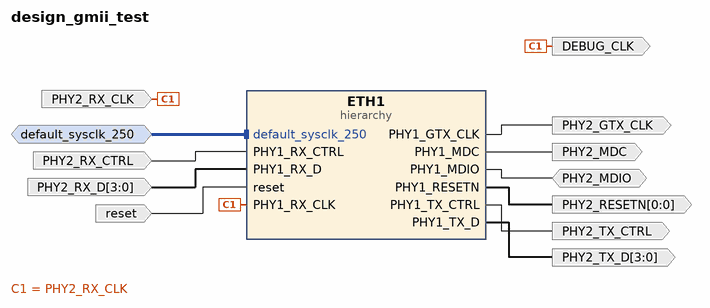
[diagram p0: block diagram of the top level]
# Vivado block design design_gmii_test, xcku040-fbva676-1-c, Vivado 2018.2
create_bd_design design_gmii_test

create_bd_intf_port -mode Slave -vlnv xilinx.com:interface:diff_clock_rtl:1.0 default_sysclk_250
set_property -dict {CONFIG.FREQ_HZ 250000000} [get_bd_intf_ports default_sysclk_250]
create_bd_port -dir I -type clk PHY2_RX_CLK
set_property -dict {CONFIG.FREQ_HZ 125000000} [get_bd_ports PHY2_RX_CLK]
create_bd_port -dir O -type clk DEBUG_CLK
create_bd_port -dir I PHY2_RX_CTRL
create_bd_port -dir I -from 3 -to 0 PHY2_RX_D
create_bd_port -dir O -type clk PHY2_GTX_CLK
create_bd_port -dir O -from 0 -to 0 PHY2_RESETN
create_bd_port -dir I -type rst reset
set_property -dict {CONFIG.POLARITY ACTIVE_HIGH} [get_bd_ports reset]
create_bd_port -dir IO PHY2_MDIO
create_bd_port -dir O -type clk PHY2_MDC
create_bd_port -dir O -from 3 -to 0 PHY2_TX_D
create_bd_port -dir O PHY2_TX_CTRL

create_bd_cell -type hier ETH1

# ---- hierarchy /ETH1 ----
current_bd_instance /ETH1
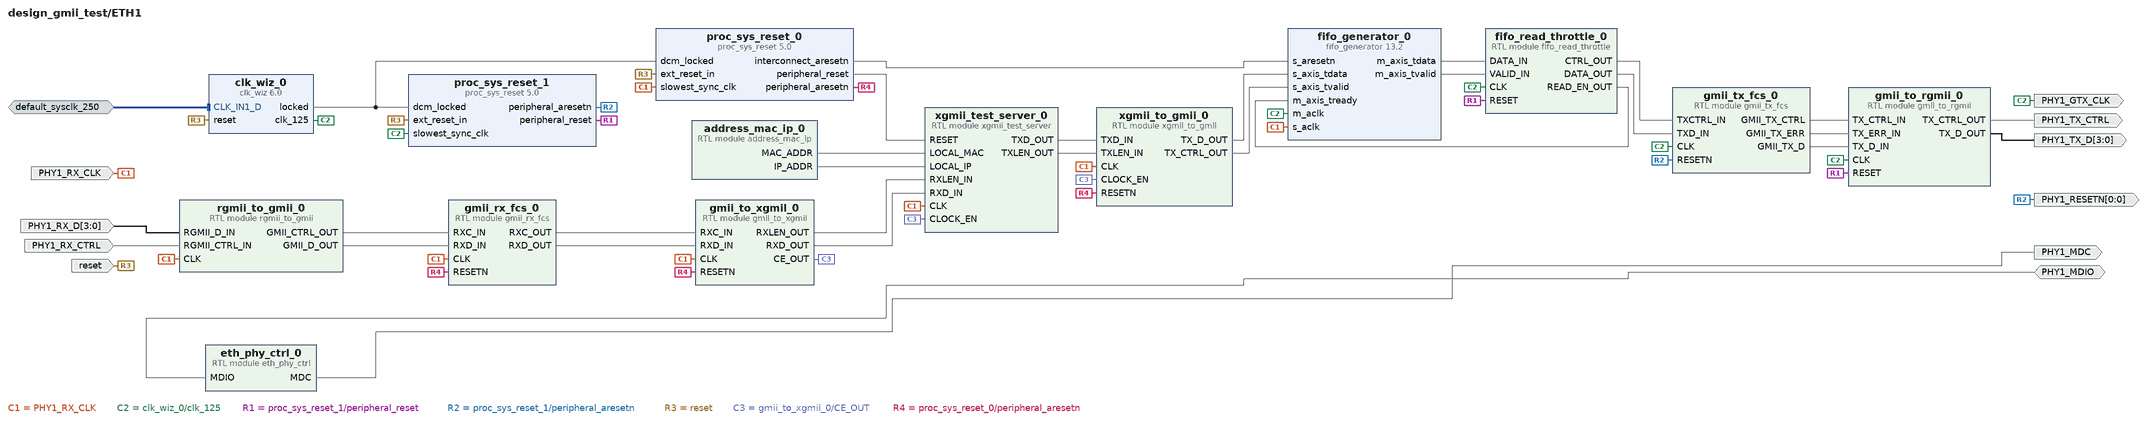
[diagram p1: block diagram inside /ETH1]
create_bd_intf_pin -mode Slave -vlnv xilinx.com:interface:diff_clock_rtl:1.0 default_sysclk_250
create_bd_pin -dir IO PHY1_MDIO
create_bd_pin -dir I -from 3 -to 0 PHY1_RX_D
create_bd_pin -dir I PHY1_RX_CTRL
create_bd_pin -dir O PHY1_MDC
create_bd_pin -dir I -type clk PHY1_RX_CLK
create_bd_pin -dir O -from 3 -to 0 PHY1_TX_D
create_bd_pin -dir O PHY1_TX_CTRL
create_bd_pin -dir I -type rst reset
create_bd_pin -dir O -from 0 -to 0 -type rst PHY1_RESETN
create_bd_pin -dir O -type clk PHY1_GTX_CLK

create_bd_cell -type module -reference gmii_tx_fcs gmii_tx_fcs_0
create_bd_cell -type ip -vlnv xilinx.com:ip:proc_sys_reset:5.0 proc_sys_reset_1
create_bd_cell -type module -reference fifo_read_throttle fifo_read_throttle_0
create_bd_cell -type ip -vlnv xilinx.com:ip:fifo_generator:13.2 fifo_generator_0
set_property -dict [list \
  CONFIG.Fifo_Implementation Independent_Clocks_Distributed_RAM \
  CONFIG.INTERFACE_TYPE AXI_STREAM \
  CONFIG.Performance_Options Standard_FIFO \
  CONFIG.Input_Data_Width 8 \
  CONFIG.Input_Depth 32 \
  CONFIG.Full_Flags_Reset_Value 1 \
  CONFIG.Valid_Flag true \
  CONFIG.Clock_Type_AXI Independent_Clock \
  CONFIG.TUSER_WIDTH 0 \
  CONFIG.FIFO_Implementation_wach Independent_Clocks_Distributed_RAM \
  CONFIG.FIFO_Implementation_wdch Independent_Clocks_Builtin_FIFO \
  CONFIG.FIFO_Implementation_wrch Independent_Clocks_Distributed_RAM \
  CONFIG.FIFO_Implementation_rach Independent_Clocks_Distributed_RAM \
  CONFIG.FIFO_Implementation_rdch Independent_Clocks_Builtin_FIFO \
  CONFIG.FIFO_Implementation_axis Independent_Clocks_Distributed_RAM \
  CONFIG.Input_Depth_axis 32 \
] [get_bd_cells fifo_generator_0]
create_bd_cell -type module -reference gmii_to_xgmil gmii_to_xgmil_0
create_bd_cell -type module -reference address_mac_ip address_mac_ip_0
set_property -dict {CONFIG.IP2 100 CONFIG.IP3 251} [get_bd_cells address_mac_ip_0]
create_bd_cell -type ip -vlnv xilinx.com:ip:proc_sys_reset:5.0 proc_sys_reset_0
create_bd_cell -type module -reference gmii_rx_fcs gmii_rx_fcs_0
create_bd_cell -type ip -vlnv xilinx.com:ip:clk_wiz:6.0 clk_wiz_0
set_property -dict [list \
  CONFIG.USE_PHASE_ALIGNMENT true \
  CONFIG.CLKIN1_JITTER_PS 40.0 \
  CONFIG.CLKOUT1_USED true \
  CONFIG.CLKOUT2_USED true \
  CONFIG.CLKOUT3_USED false \
  CONFIG.NUM_OUT_CLKS 2 \
  CONFIG.CLK_OUT1_PORT clk_125 \
  CONFIG.CLK_OUT2_PORT clk_ila \
  CONFIG.CLK_OUT3_PORT clk_out3 \
  CONFIG.CLKOUT1_REQUESTED_OUT_FREQ 125.000 \
  CONFIG.CLKOUT2_REQUESTED_OUT_FREQ 375.000 \
  CONFIG.CLKOUT3_REQUESTED_OUT_FREQ 100.000 \
  CONFIG.PRIM_SOURCE Differential_clock_capable_pin \
  CONFIG.MMCM_DIVCLK_DIVIDE 1 \
  CONFIG.MMCM_CLKFBOUT_MULT_F 4.500 \
  CONFIG.MMCM_CLKIN1_PERIOD 4.000 \
  CONFIG.MMCM_CLKIN2_PERIOD 10.0 \
  CONFIG.MMCM_CLKOUT0_DIVIDE_F 9.000 \
  CONFIG.MMCM_CLKOUT1_DIVIDE 3 \
  CONFIG.MMCM_CLKOUT2_DIVIDE 1 \
  CONFIG.USE_BOARD_FLOW true \
  CONFIG.CLK_IN1_BOARD_INTERFACE default_sysclk_250 \
  CONFIG.RESET_BOARD_INTERFACE reset \
  CONFIG.CLKOUT1_JITTER 99.067 \
  CONFIG.CLKOUT1_PHASE_ERROR 80.553 \
  CONFIG.CLKOUT2_JITTER 79.919 \
  CONFIG.CLKOUT2_PHASE_ERROR 80.553 \
  CONFIG.CLKOUT3_JITTER 89.528 \
  CONFIG.CLKOUT3_PHASE_ERROR 85.928 \
] [get_bd_cells clk_wiz_0]
create_bd_cell -type module -reference xgmii_test_server xgmii_test_server_0
create_bd_cell -type module -reference xgmii_to_gmii xgmii_to_gmii_0
create_bd_cell -type module -reference rgmii_to_gmii rgmii_to_gmii_0
create_bd_cell -type module -reference gmii_to_rgmii gmii_to_rgmii_0
create_bd_cell -type module -reference eth_phy_ctrl eth_phy_ctrl_0

# ---- connections ----

current_bd_instance /ETH1
connect_bd_intf_net [get_bd_intf_pins default_sysclk_250] [get_bd_intf_pins clk_wiz_0/CLK_IN1_D]
connect_bd_net [get_bd_pins PHY1_MDIO] [get_bd_pins eth_phy_ctrl_0/MDIO]
connect_bd_net [get_bd_pins PHY1_RX_D] [get_bd_pins rgmii_to_gmii_0/RGMII_D_IN]
connect_bd_net [get_bd_pins PHY1_RX_CTRL] [get_bd_pins rgmii_to_gmii_0/RGMII_CTRL_IN]
connect_bd_net [get_bd_pins eth_phy_ctrl_0/MDC] [get_bd_pins PHY1_MDC]
connect_bd_net [get_bd_pins PHY1_RX_CLK] \
  [get_bd_pins fifo_generator_0/s_aclk] [get_bd_pins gmii_to_xgmil_0/CLK] [get_bd_pins proc_sys_reset_0/slowest_sync_clk] \
  [get_bd_pins gmii_rx_fcs_0/CLK] [get_bd_pins xgmii_test_server_0/CLK] [get_bd_pins xgmii_to_gmii_0/CLK] \
  [get_bd_pins rgmii_to_gmii_0/CLK]
connect_bd_net -net CLK_1 [get_bd_pins clk_wiz_0/clk_125] \
  [get_bd_pins PHY1_GTX_CLK] [get_bd_pins gmii_tx_fcs_0/CLK] [get_bd_pins proc_sys_reset_1/slowest_sync_clk] \
  [get_bd_pins fifo_read_throttle_0/CLK] [get_bd_pins fifo_generator_0/m_aclk] [get_bd_pins gmii_to_rgmii_0/CLK]
connect_bd_net [get_bd_pins gmii_tx_fcs_0/GMII_TX_CTRL] [get_bd_pins gmii_to_rgmii_0/TX_CTRL_IN]
connect_bd_net [get_bd_pins gmii_tx_fcs_0/GMII_TX_ERR] [get_bd_pins gmii_to_rgmii_0/TX_ERR_IN]
connect_bd_net [get_bd_pins gmii_tx_fcs_0/GMII_TX_D] [get_bd_pins gmii_to_rgmii_0/TX_D_IN]
connect_bd_net [get_bd_pins gmii_to_rgmii_0/TX_D_OUT] [get_bd_pins PHY1_TX_D]
connect_bd_net [get_bd_pins gmii_to_rgmii_0/TX_CTRL_OUT] [get_bd_pins PHY1_TX_CTRL]
connect_bd_net [get_bd_pins proc_sys_reset_1/peripheral_reset] [get_bd_pins fifo_read_throttle_0/RESET] [get_bd_pins gmii_to_rgmii_0/RESET]
connect_bd_net [get_bd_pins proc_sys_reset_1/peripheral_aresetn] [get_bd_pins PHY1_RESETN] [get_bd_pins gmii_tx_fcs_0/RESETN]
connect_bd_net [get_bd_pins reset] \
  [get_bd_pins proc_sys_reset_1/ext_reset_in] [get_bd_pins proc_sys_reset_0/ext_reset_in] [get_bd_pins clk_wiz_0/reset]
connect_bd_net [get_bd_pins clk_wiz_0/locked] [get_bd_pins proc_sys_reset_1/dcm_locked] [get_bd_pins proc_sys_reset_0/dcm_locked]
connect_bd_net [get_bd_pins fifo_read_throttle_0/CTRL_OUT] [get_bd_pins gmii_tx_fcs_0/TXCTRL_IN]
connect_bd_net [get_bd_pins fifo_read_throttle_0/DATA_OUT] [get_bd_pins gmii_tx_fcs_0/TXD_IN]
connect_bd_net [get_bd_pins fifo_generator_0/m_axis_tdata] [get_bd_pins fifo_read_throttle_0/DATA_IN]
connect_bd_net [get_bd_pins fifo_generator_0/m_axis_tvalid] [get_bd_pins fifo_read_throttle_0/VALID_IN]
connect_bd_net [get_bd_pins fifo_read_throttle_0/READ_EN_OUT] [get_bd_pins fifo_generator_0/m_axis_tready]
connect_bd_net -net CE_1 [get_bd_pins gmii_to_xgmil_0/CE_OUT] [get_bd_pins xgmii_test_server_0/CLOCK_EN] [get_bd_pins xgmii_to_gmii_0/CLOCK_EN]
connect_bd_net [get_bd_pins xgmii_to_gmii_0/TX_D_OUT] [get_bd_pins fifo_generator_0/s_axis_tdata]
connect_bd_net [get_bd_pins xgmii_to_gmii_0/TX_CTRL_OUT] [get_bd_pins fifo_generator_0/s_axis_tvalid]
connect_bd_net [get_bd_pins xgmii_test_server_0/TXD_OUT] [get_bd_pins xgmii_to_gmii_0/TXD_IN]
connect_bd_net [get_bd_pins xgmii_test_server_0/TXLEN_OUT] [get_bd_pins xgmii_to_gmii_0/TXLEN_IN]
connect_bd_net [get_bd_pins gmii_to_xgmil_0/RXLEN_OUT] [get_bd_pins xgmii_test_server_0/RXLEN_IN]
connect_bd_net [get_bd_pins gmii_to_xgmil_0/RXD_OUT] [get_bd_pins xgmii_test_server_0/RXD_IN]
connect_bd_net [get_bd_pins address_mac_ip_0/MAC_ADDR] [get_bd_pins xgmii_test_server_0/LOCAL_MAC]
connect_bd_net [get_bd_pins address_mac_ip_0/IP_ADDR] [get_bd_pins xgmii_test_server_0/LOCAL_IP]
connect_bd_net [get_bd_pins proc_sys_reset_0/peripheral_reset] [get_bd_pins xgmii_test_server_0/RESET]
connect_bd_net [get_bd_pins proc_sys_reset_0/peripheral_aresetn] \
  [get_bd_pins gmii_to_xgmil_0/RESETN] [get_bd_pins gmii_rx_fcs_0/RESETN] [get_bd_pins xgmii_to_gmii_0/RESETN]
connect_bd_net [get_bd_pins proc_sys_reset_0/interconnect_aresetn] [get_bd_pins fifo_generator_0/s_aresetn]
connect_bd_net [get_bd_pins gmii_rx_fcs_0/RXC_OUT] [get_bd_pins gmii_to_xgmil_0/RXC_IN]
connect_bd_net [get_bd_pins gmii_rx_fcs_0/RXD_OUT] [get_bd_pins gmii_to_xgmil_0/RXD_IN]
connect_bd_net [get_bd_pins rgmii_to_gmii_0/GMII_CTRL_OUT] [get_bd_pins gmii_rx_fcs_0/RXC_IN]
connect_bd_net [get_bd_pins rgmii_to_gmii_0/GMII_D_OUT] [get_bd_pins gmii_rx_fcs_0/RXD_IN]

current_bd_instance /
connect_bd_intf_net -intf_net default_sysclk_250_1 [get_bd_intf_ports default_sysclk_250] [get_bd_intf_pins ETH1/default_sysclk_250]
connect_bd_net -net PHY1_RX_CLK_1 [get_bd_ports PHY2_RX_CLK] [get_bd_ports DEBUG_CLK] [get_bd_pins ETH1/PHY1_RX_CLK]
connect_bd_net -net RGMII_CTRL_IN_1 [get_bd_ports PHY2_RX_CTRL] [get_bd_pins ETH1/PHY1_RX_CTRL]
connect_bd_net -net RGMII_D_IN_1 [get_bd_ports PHY2_RX_D] [get_bd_pins ETH1/PHY1_RX_D]
connect_bd_net -net clk_wiz_0_clk_125 [get_bd_pins ETH1/PHY1_GTX_CLK] [get_bd_ports PHY2_GTX_CLK]
connect_bd_net -net proc_sys_reset_1_peripheral_aresetn [get_bd_pins ETH1/PHY1_RESETN] [get_bd_ports PHY2_RESETN]
connect_bd_net [get_bd_ports reset] [get_bd_pins ETH1/reset]
connect_bd_net [get_bd_ports PHY2_MDIO] [get_bd_pins ETH1/PHY1_MDIO]
connect_bd_net [get_bd_pins ETH1/PHY1_MDC] [get_bd_ports PHY2_MDC]
connect_bd_net [get_bd_pins ETH1/PHY1_TX_D] [get_bd_ports PHY2_TX_D]
connect_bd_net [get_bd_pins ETH1/PHY1_TX_CTRL] [get_bd_ports PHY2_TX_CTRL]

validate_bd_design
save_bd_design
